# EAGLE design io8 (EAGLE 6.5.0)
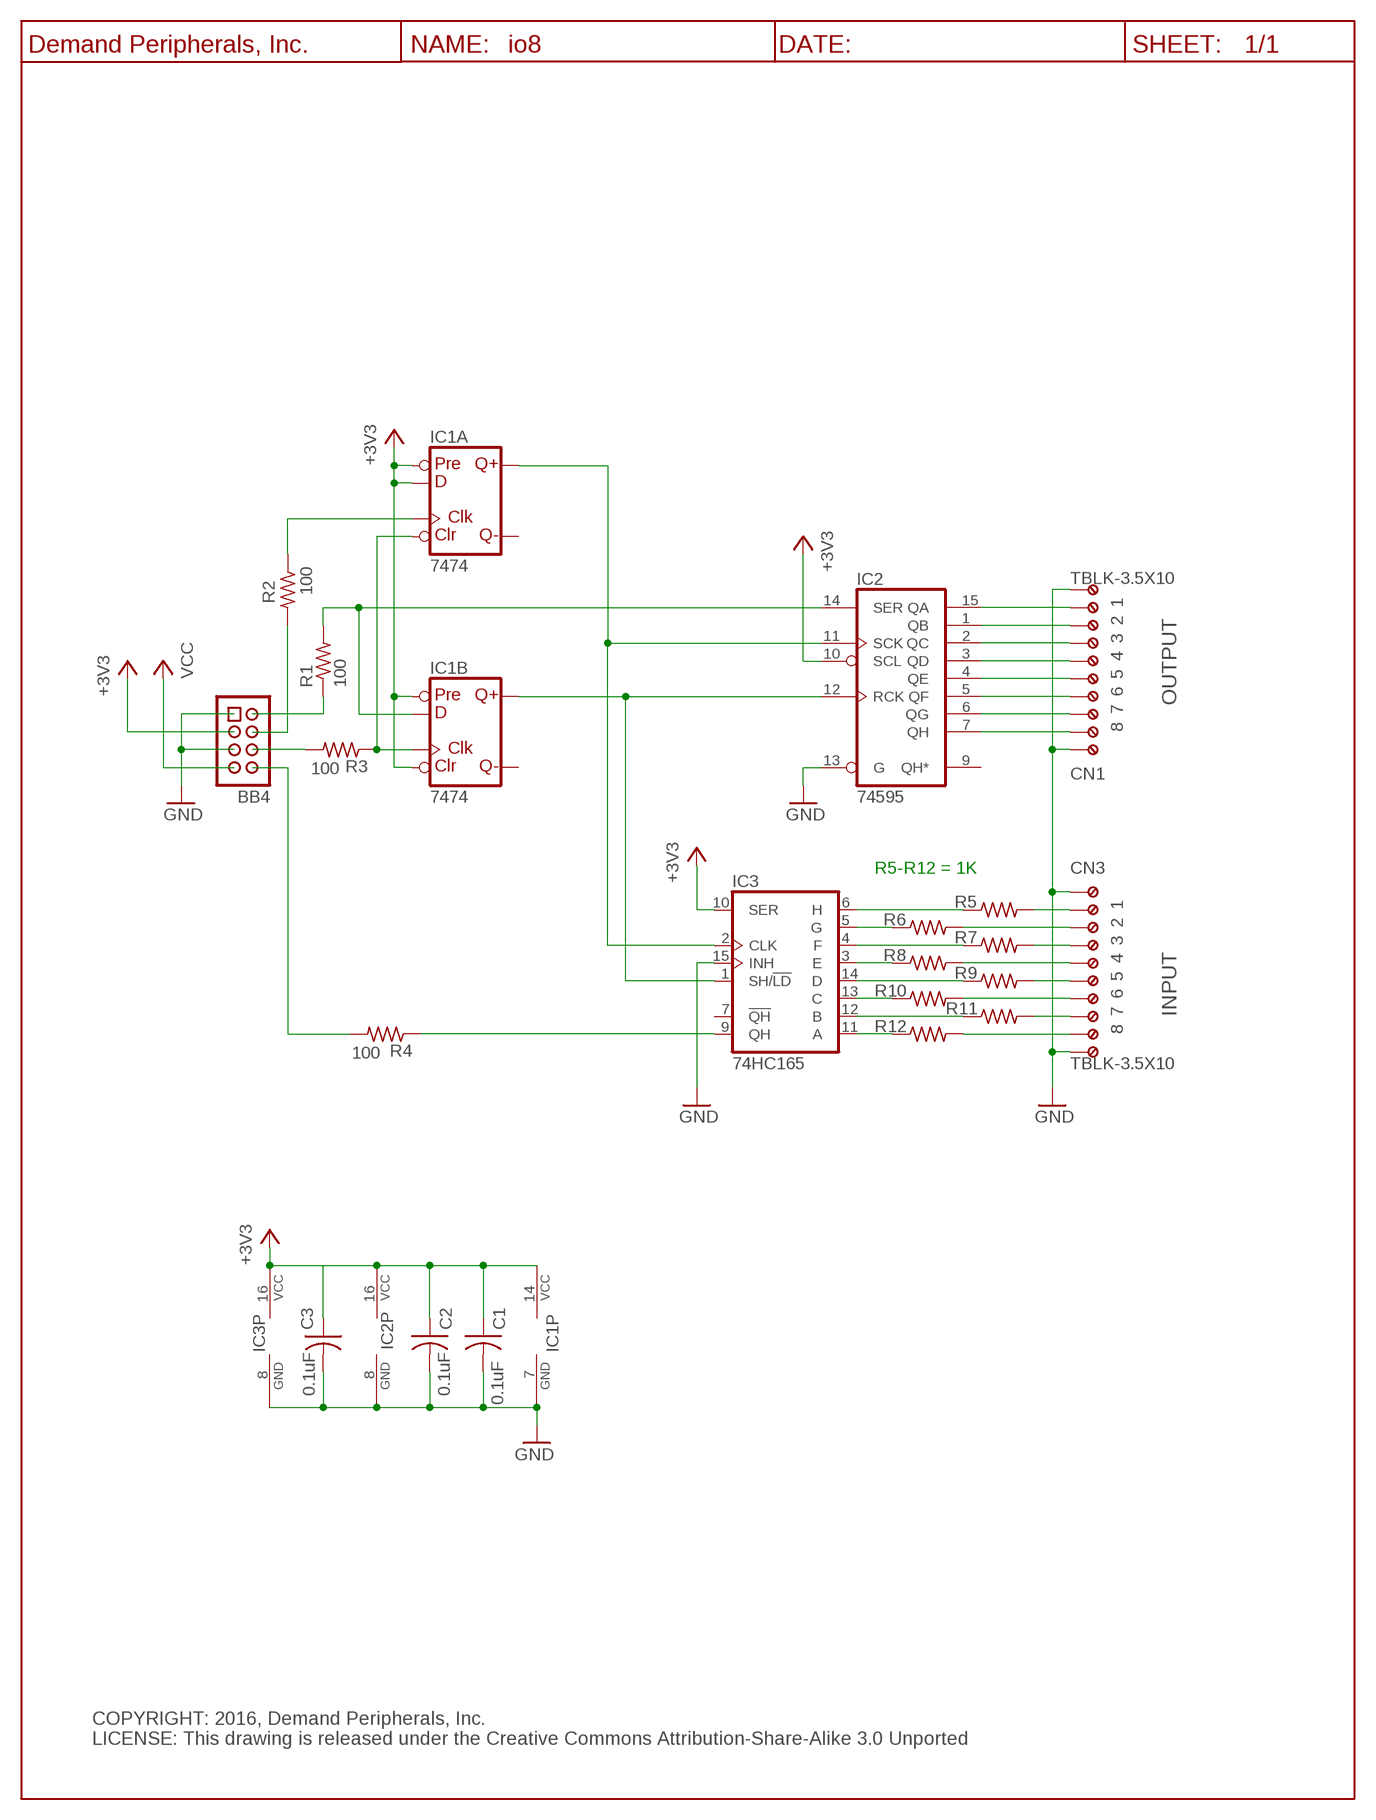
[diagram p0: schematic, sheet 1]

## Parts
BB4  Hdr_4x2  HDR-4X2-SHR  [HDR-4X2]
C1  0.1uF  C0.1UF_C0603  [C0603]
C2  0.1uF  C0.1UF_C0603  [C0603]
C3  0.1uF  C0.1UF_C0603  [C0603]
CN1  TBLK-3.5X10  [TBLK-3.5X10]
CN3  TBLK-3.5X10  [TBLK-3.5X10]
IC1  7474  74AHC74  [SO14]
IC2  74595  [SO16]
IC3  74HC165  [SO16]
R1  100  R100_R0603  [R0603]
R2  100  R100_R0603  [R0603]
R3  100  R100_R0603  [R0603]
R4  100  R100_R0603  [R0603]
R5  R1K_R0603  [R0603]
R6  R1K_R0603  [R0603]
R7  R1K_R0603  [R0603]
R8  R1K_R0603  [R0603]
R9  R1K_R0603  [R0603]
R10  R1K_R0603  [R0603]
R11  R1K_R0603  [R0603]
R12  R1K_R0603  [R0603]
U$5  DP_FRAME_P  [P_FRAME]

## Nets
+3V3: BB4.3 C1.1 C2.1 C3.1 IC1.2(A:D) IC1.4(A:PRE) IC1.10(B:PRE) IC1.13(B:CLR) IC1.14(P:VCC) IC2.10(SCL) IC2.16(VCC) IC3.10(SER) IC3.16(VCC)
GND: BB4.1 BB4.5 C1.2 C2.2 C3.2 CN1.1(KL) CN1.10(KL9) CN3.1(KL) CN3.10(KL9) IC1.7(P:GND) IC2.8(GND) IC2.13(G) IC3.8(GND) IC3.15(INH)
N$1: BB4.2 R1.1
N$2: BB4.8 R4.2
N$3: CN3.9(KL8) R12.2
N$4: CN3.8(KL7) R11.2
N$5: CN3.7(KL6) R10.2
N$6: IC1.12(B:D) IC2.14(SER) R1.2
N$7: CN3.6(KL5) R9.2
N$8: CN3.5(KL4) R8.2
N$9: CN3.4(KL3) R7.2
N$10: CN3.3(KL2) R6.2
N$11: CN3.2(KL1) R5.2
N$12: IC1.5(A:Q) IC2.11(SCK) IC3.2(CLK)
N$13: IC3.11(A) R12.1
N$14: CN1.2(KL1) IC2.7(QH)
N$15: IC1.1(A:CLR) IC1.11(B:CLK) R3.1
N$17: BB4.4 R2.2
N$18: IC1.3(A:CLK) R2.1
N$19: BB4.6 R3.2
N$21: CN1.3(KL2) IC2.6(QG)
N$22: CN1.4(KL3) IC2.5(QF)
N$23: CN1.5(KL4) IC2.4(QE)
N$24: CN1.6(KL5) IC2.3(QD)
N$25: CN1.7(KL6) IC2.2(QC)
N$26: CN1.8(KL7) IC2.1(QB)
N$27: CN1.9(KL8) IC2.15(QA)
N$33: IC3.9(QH) R4.1
N$34: IC3.12(B) R11.1
N$35: IC1.9(B:Q) IC2.12(RCK) IC3.1(SH/!LD)
N$47: IC3.13(C) R10.1
N$48: IC3.14(D) R9.1
N$49: IC3.3(E) R8.1
N$50: IC3.4(F) R7.1
N$51: IC3.5(G) R6.1
N$52: IC3.6(H) R5.1
VCC: BB4.7
Unconnected: IC1.6(A:!Q) IC1.8(B:!Q) IC2.9(QH*) IC3.7(!QH)

## Notes on the sheet
- 1
- 2
- 3
- 4
- 5
- 6
- OUTPUT
- 7
- 8
- R5-R12 = 1K
- 1
- 2
- 3
- 4
- 5
- 6
- 7 | INPUT
- 8
- COPYRIGHT: 2016, Demand Peripherals, Inc.
  LICENSE: This drawing is released under the Creative Commons Attribution-Share-Alike 3.0 Unported

## Library data of the parts
BB4 = dpi-conn:HDR-4X2-SHR: Shrouded 4x2 pin header; VENDOR: Digikey; VENDOR-PART-NUM: 609-3530-ND
C1-C3 = dpi-passive:C0.1UF_: 0.1 uF Capacitor, 25V, X7R; VENDOR: Digikey; VENDOR-PART-NUM: 1276-1126-2-ND
CN1 CN3 = dpi-conn:TBLK-3.5X10: Terminal Block, 3.5mm, x10, screw terminals; VENDOR: Digikey; VENDOR-PART-NUM: ED2735-ND
IC1 = dpi-transic:74AHC74: Dual D type positive edge triggered FLIP FLOP, preset and clear; VENDOR: Digikey; VENDOR-PART-NUM: 568-4458-1-ND
IC2 = dpi-transic:74*595: 8-bit SHIFT REGISTER, output latch; VENDOR: Digikey; VENDOR-PART-NUM: 74HC595D(BJ)CT-ND
IC3 = dpi-transic:74HC165: NXP 74HC165 parallel-to-serial shift register; VENDOR: Digikey; VENDOR-PART-NUM: 568-1409-1-ND
R1-R4 = dpi-passive:R100_: 100 Ohm resistor, 1%, 0.1 watt; VENDOR: Digikey; VENDOR-PART-NUM: 311-100HRTR-ND
R5-R12 = dpi-passive:R1K_: 1K Resistor, 1%, 0.1 watt; VENDOR: Digikey; VENDOR-PART-NUM: 311-1.00KHRTR-ND
U$5 = dpi-sym:DP_FRAME_P: Portrait/Letter Document Frame

## Board
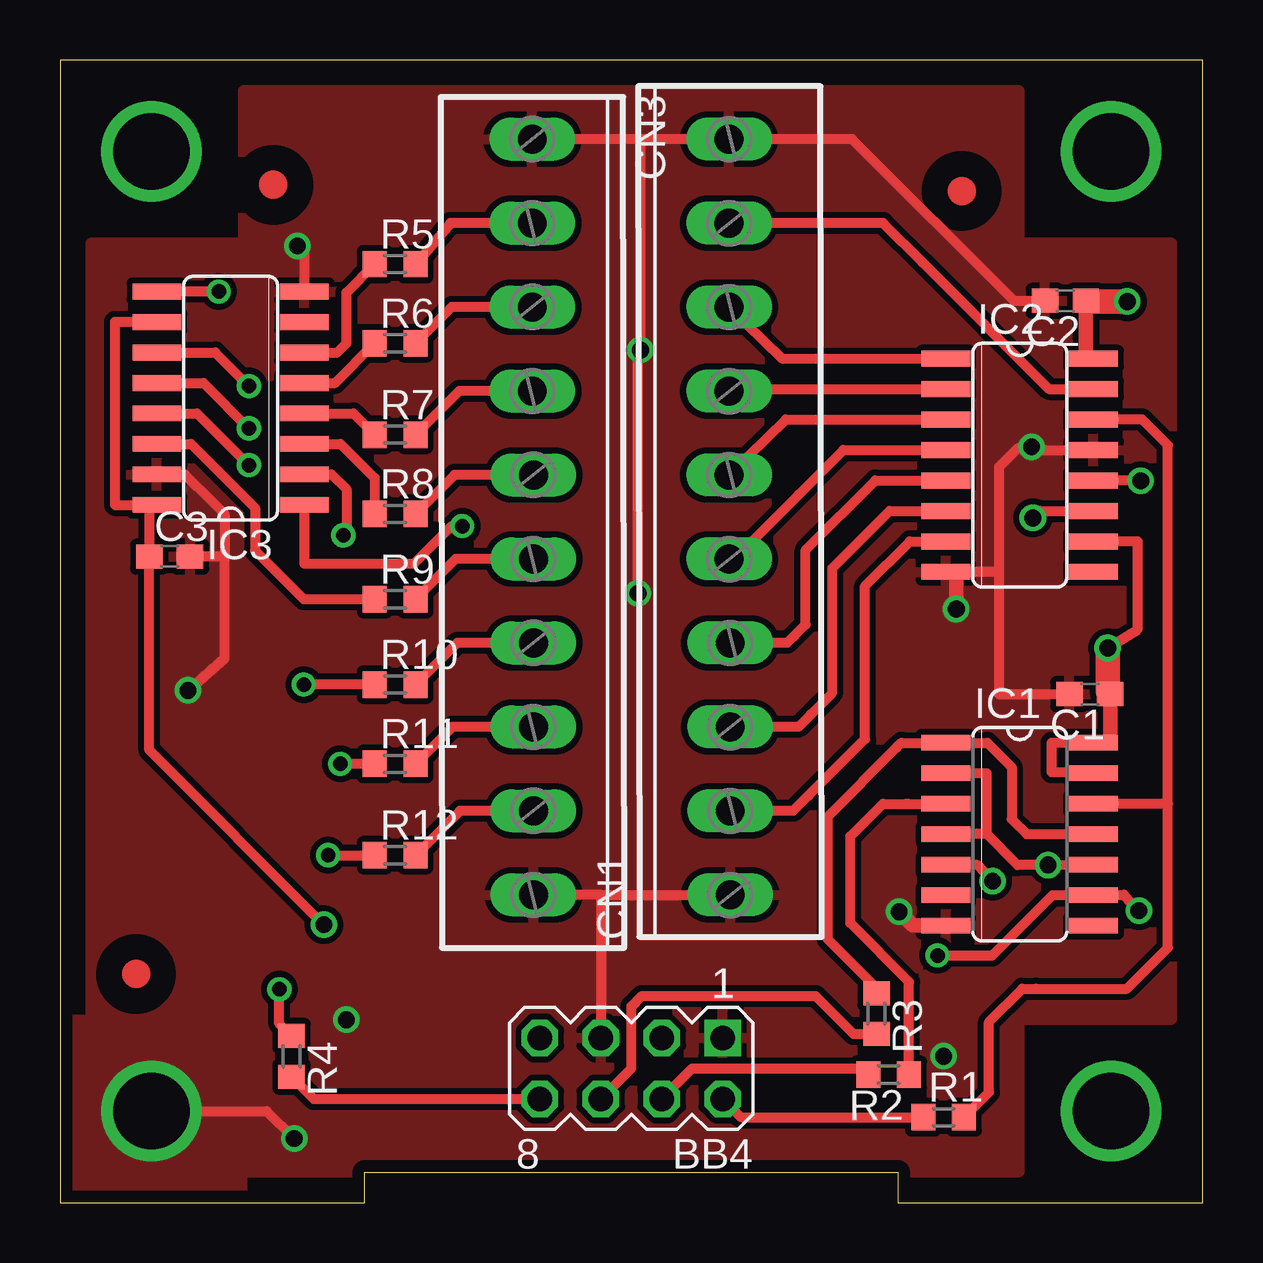
[diagram p1: board, top side]
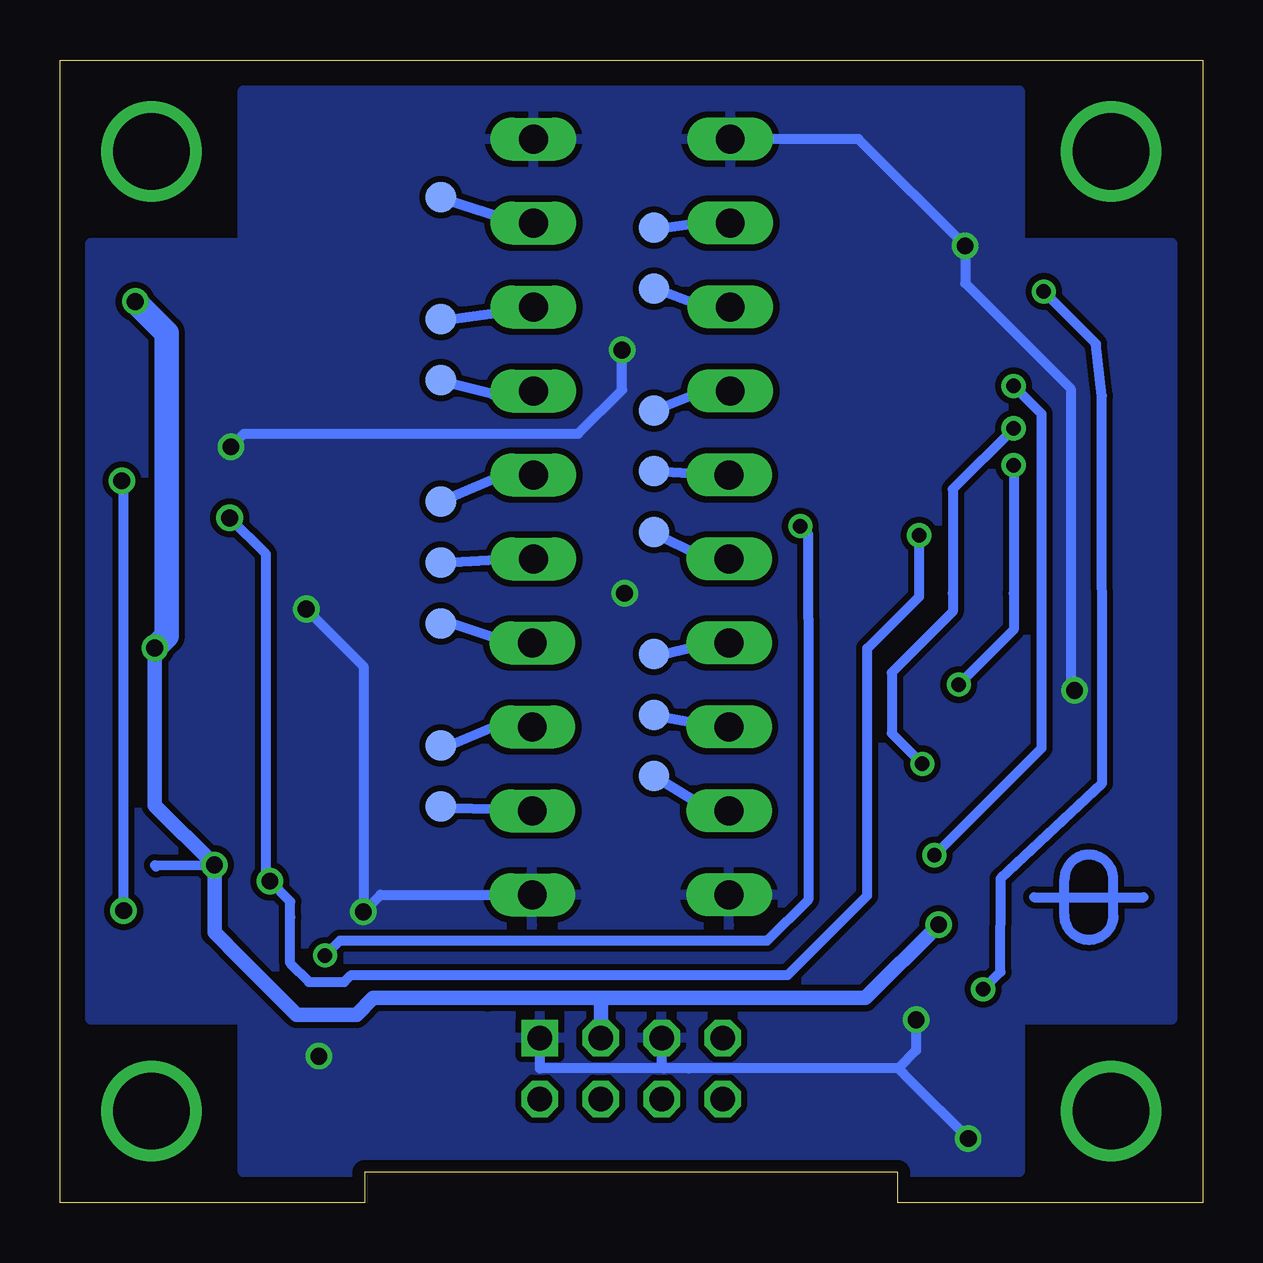
[diagram p2: board, bottom side, seen from below]

Size 47.62 x 47.62 mm. Coordinates in mm from the lower left corner, seen from the top.
Outline: 0,0 12.7,0 12.7,1.27 34.92,1.27 34.92,0 47.62,0 47.62,47.62 0,47.62 0,0
Copper layers (1*16): Top 0.035mm / dielectric 1.5mm / Bottom 0.035mm
Design rules "default *": minimum track width 10mil, minimum drill 20mil, track to track 10mil, track to pad 10mil, pad to pad 10mil, via to via 10mil, smd to smd 10mil, copper to edge 20mil, drill to drill 10mil, minimum pad ring 10mil, minimum via ring 8mil, stop-mask expansion 4mil, vias tented up to drill 0mil, thermal gap 10mil
tKeepout: area 15.1,1 to 32.5,9.7; area 15.1,0.5 to 32.5,9.7

### Footprints (pad centres in the part's own frame; a part is rotated, then mirrored left to right if it is on the bottom)
HDR-4X2 = drill 1.016 square: 1 -3.81,-1.27 | drill 1.016 octagon: 2 -3.81,1.27; 3 -1.27,-1.27; 4 -1.27,1.27; 5 1.27,-1.27; 6 1.27,1.27; 7 3.81,-1.27; 8 3.81,1.27
C0603 = smd 1.1 x 1: 1 -0.85,0; 2 0.85,0
TBLK-3.5X10 = drill 1.2 long: 1 -15.75,0; 2 -12.25,0; 3 -8.75,0; 4 -5.25,0; 5 -1.75,0.05; 6 1.75,0.05; 7 5.25,0.05; 8 8.75,0.05; 9 12.25,0.05; 10 15.75,0.05
TEST-POINT = smd 1.27 x 1.27: P1 0,0
SO14 = smd 0.66 x 2.032: 1 -3.81,-3.073; 2 -2.54,-3.073; 3 -1.27,-3.073; 4 0,-3.073; 5 1.27,-3.073; 6 2.54,-3.073; 7 3.81,-3.073; 8 3.81,3.073; 9 2.54,3.073; 10 1.27,3.073; 11 0,3.073; 12 -1.27,3.073; 13 -2.54,3.073; 14 -3.81,3.073
SO16 = smd 0.66 x 2.032: 1 -4.445,-3.073; 2 -3.175,-3.073; 3 -1.905,-3.073; 4 -0.635,-3.073; 5 0.635,-3.073; 6 1.905,-3.073; 7 3.175,-3.073; 8 4.445,-3.073; 9 4.445,3.073; 10 3.175,3.073; 11 1.905,3.073; 12 0.635,3.073; 13 -0.635,3.073; 14 -1.905,3.073; 15 -3.175,3.073; 16 -4.445,3.073
R0603 = smd 1 x 1.1: 1 -0.85,0; 2 0.85,0

### Placement (x,y rotation side)
BB4  23.81,5.59 180 top
C1  42.93,21.2 180 top
C2  41.91,37.59 180 top
C3  4.57,26.92 0 top
CN1  27.94,28.57 90 top
CN3  19.68,28.57 270 top
E$2  [TEST-POINT]  22.86,40.64 0 bottom
E$4  [TEST-POINT]  31.75,41.91 0 bottom
E$5  [TEST-POINT]  22.86,38.09 0 bottom
E$6  [TEST-POINT]  31.75,36.83 0 bottom
E$7  [TEST-POINT]  22.86,33.02 0 bottom
E$8  [TEST-POINT]  31.75,34.29 0 bottom
E$9  [TEST-POINT]  22.87,30.48 0 bottom
E$10  [TEST-POINT]  31.75,29.21 0 bottom
E$11  [TEST-POINT]  22.86,27.94 0 bottom
E$12  [TEST-POINT]  31.75,26.67 0 bottom
E$13  [TEST-POINT]  22.86,22.86 0 bottom
E$14  [TEST-POINT]  31.75,24.13 0 bottom
E$15  [TEST-POINT]  22.86,20.32 0 bottom
E$16  [TEST-POINT]  22.86,17.78 0 bottom
E$18  [TEST-POINT]  31.75,19.05 0 bottom
E$19  [TEST-POINT]  31.75,16.51 0 bottom
IC1  40.01,15.35 270 top
IC2  40.01,30.73 270 top
IC3  7.11,33.53 90 top
R1  36.83,3.56 0 top
R2  34.54,5.33 180 top
R3  34.04,7.87 270 top
R4  9.65,6.1 270 top
R5  13.97,39.12 0 top
R6  13.97,35.81 0 top
R7  13.97,32 0 top
R8  13.97,28.7 0 top
R9  13.97,25.15 0 top
R10  13.97,21.59 0 top
R11  13.97,18.29 0 top
R12  13.97,14.48 0 top
U$1  [FIDUCIAL]  3.17,9.53 0 top
U$3  [FIDUCIAL]  37.59,42.16 0 top
U$4  [FIDUCIAL]  8.89,42.42 0 top
U$5  -2.54,-2.54 0 top
U$6  [DPI-1]  4.74,12.73 90 bottom

### Tracks (layer width: path | path; a pad name or v marks a point on that pad's centre or on a via)
+3V3  (via drill 0.7)
  Top 0.406: IC1.14 41.33,19.16 41.33,17.95 43.08,17.95 IC1.13 | 38.63,15.35 IC1.4 | IC2.10 44.92,27.56 44.92,23.89 v43.67,23.11 | IC1.2 38.63,17.89 38.63,15.35 | IC1.10 v41.19,14.07 39.92,14.07 38.63,15.35 | IC3.10 2.29,36.7 2.29,29.08 IC3.16 3.72,29.08 C3.1 3.72,18.86 v11,11.58
  Top 0.61: IC2.16 42.76,35.18 C2.1 | IC1.14 43.78,19.16 C1.1
  Top 1.016: v44.49,37.55 42.8,37.55 C2.1 | v43.67,23.11 43.67,21.3 C1.1
  Bottom 0.406: 43.62,14.01 43.67,14.06 v41.19,14.07
  Bottom 0.61: v43.67,23.11 43.67,16.56 v41.19,14.07 41.19,11.25 40.07,10.13 37.76,7.82 35.27,7.82 34.57,8.52 29.82,8.52 25.08,8.52 | BB4.3 25.08,8.52 | 25.08,8.52 14.06,8.52 v11,11.58
  Bottom 1.016: v43.67,23.11 43.17,23.62 43.17,36.23 v44.49,37.55
GND  (via drill 0.7, 3.17 pad 3.17)
  Top 0.406: IC2.13 40.63,31.37 40.58,31.42 | v40.5,31.5 40.58,31.42 | 39.14,26.29 IC2.8 | 39.14,26.29 39.14,30.66 39.9,31.42 40.58,31.42 | 22.54,12.82 BB4.5 | C1.2 39.14,21.2 39.14,26.29 | C2.2 39.75,37.59 33.02,44.33 CN1.10 24.32,44.33 | 24.32,44.33 CN3.1 | 22.54,12.82 CN3.10 | 22.54,12.82 CN1.1 | v3.81,3.81 8.62,3.81 v9.77,2.67 | v24.09,25.4 24.09,35.43 v24.19,35.53 24.19,44.2 24.32,44.33 | v9.89,39.88 10.19,39.59 IC3.8 | IC3.15 5.21,30.35 6.35,29.21 6.86,28.7 6.86,26.92 | 6.86,26.92 C3.2 | v5.33,21.35 6.86,22.67 6.86,26.92
  Top 0.61: v37.36,24.74 37.36,26.25 IC2.8 | IC1.7 35.55,11.54 v34.98,12.12
  Bottom 0.406: v37.36,24.74 34.98,22.35 v34.98,12.12 34.27,12.82 CN1.1 | v9.77,2.67 12.18,5.08 12.69,5.59 | 12.69,5.59 21.43,5.59 22.47,5.59 | 22.47,5.59 27.62,5.59 BB4.1 | BB4.5 22.54,5.66 22.47,5.59 | v40.5,31.5 39.95,32.04 26.02,32.04 24.19,33.87 v24.19,35.53 | v11.94,7.62 11.94,6.34 12.69,5.59 | CN3.1 14.34,44.33 v9.89,39.88 9.89,38.32 5.5,33.92 5.5,21.51 v5.33,21.35
  other vias: 36.83,6.1
  pour Top (isolate 0.254): 40.01,1.27 40.01,7.62 46.35,7.62 46.35,40.01 40.01,40.01 40.01,46.35 7.62,46.35 7.62,40.01 1.27,40.01 1.27,7.62 0.51,7.62 0.51,0.51 7.62,0.51 7.62,1.27
  pour Bottom (isolate 0.254): 40.01,1.27 40.01,7.62 46.35,7.62 46.35,40.01 40.01,40.01 40.01,46.35 7.62,46.35 7.62,40.01 1.27,40.01 1.27,7.62 7.62,7.62 7.62,1.27
MOUNT  (via drill 3.17 pad 3.17)
  other vias: 43.81,43.81
N$1
  Top 0.406: BB4.2 28.38,3.56 R1.1
N$2
  Top 0.406: R4.2 10.58,4.32 BB4.8
N$3
  Top 0.406: CN3.9 16.67,16.32 R12.2
N$4
  Top 0.406: CN3.8 16.36,19.82 R11.2
N$5
  Top 0.406: CN3.7 16.55,23.32 R10.2
N$6
  Top 0.406: IC2.14 45.11,32.64 46.18,31.57 46.18,16.62 | 46.18,16.62 46.18,10.62 44.48,8.91 40.69,8.91 40.11,8.91 38.72,7.53 38.72,4.6 R1.2 | 46.18,16.62 IC1.12
N$7
  Top 0.406: CN3.6 16.5,26.82 R9.2
N$8
  Top 0.406: CN3.5 16.44,30.32 R8.2
N$9
  Top 0.406: CN3.4 16.64,33.83 R7.2
N$10
  Top 0.406: CN3.3 16.33,37.33 R6.2
N$11
  Top 0.406: CN3.2 16.27,40.83 R5.2
N$12  (via drill 0.6, 0.7)
  Top 0.406: IC2.11 40.84,28.83 v40.55,28.54 | IC1.5 38.24,14.07 v38.88,13.4 | IC3.2 11.32,30.35 11.94,29.73 11.94,27.94 v11.81,27.81
  Bottom 0.406: v40.55,28.54 39.04,27.03 39.04,25.74 39.04,13.56 v38.88,13.4 38.02,12.55 38.02,11.89 38.02,9.97 37.25,9.2 35.78,9.2 35.48,9.49 32.82,9.49 17.29,9.49 13.97,12.8 13.97,23.1 11.81,25.26 v11.81,27.81
N$13  (via drill 0.6)
  Top 0.406: IC3.11 6.48,35.43 v7.87,34.04 | v11.18,14.48 R12.1
  Bottom 0.406: v7.87,34.04 6.72,32.88 6.72,23.57 6.72,18.94 v11.18,14.48
N$14
  Top 0.406: IC2.7 35.42,27.56 33.55,25.69 33.55,19.32 31.2,16.97 30.56,16.32 CN1.2
N$15
  Top 0.406: IC1.11 40.3,15.35 39.67,15.98 39.67,18.14 38.65,19.16 IC1.1 35.08,19.16 34.87,18.96 32,16.09 32,13.66 32,10.97 34.04,8.94 R3.1
N$16
  Bottom 0.406: 31.39,41.76 29.36,41.11
N$17
  Top 0.406: BB4.4 26.35,5.59 27.85,5.59 33.19,5.59 R2.2
N$18
  Top 0.406: 35.28,16.62 35.36,16.62 | 35.36,16.62 IC1.3 | R2.1 35.39,9.2 32.94,11.65 32.94,15.27 34.3,16.62 35.36,16.62
N$19
  Top 0.406: BB4.6 23.81,5.59 23.81,7.37 23.81,8.18 24.24,8.61 31.5,8.61 33.05,7.06 33.08,7.02 R3.2
N$20
  Bottom 0.406: 29.5,37.06 31.32,36.8
N$21
  Top 0.406: IC2.6 34.58,28.83 32.19,26.44 32.19,21.25 31.29,20.34 30.77,19.82 CN1.3
N$22
  Top 0.406: IC2.5 33.98,30.1 31.08,27.19 31.08,24.09 30.59,23.61 30.31,23.32 CN1.4
N$23
  Top 0.406: IC2.4 32.65,31.37 30.8,29.52 28.11,26.82 CN1.5
N$24
  Top 0.406: IC2.3 30.25,32.64 CN1.6
N$25
  Top 0.406: IC2.2 28.02,33.91 CN1.7
N$26
  Top 0.406: IC2.1 30.09,35.18 CN1.8
N$27
  Top 0.406: IC2.15 41.22,33.91 35.94,39.19 34.31,40.83 CN1.9
N$28
  Bottom 0.406: 29.6,33.69 31.27,34.12
N$29
  Bottom 0.406: 29.27,30.26 31.28,29.41
N$30
  Bottom 0.406: 29.38,26.77 31.24,26.67
N$31
  Bottom 0.406: 29.53,23.55 31.22,24.11
N$32
  Bottom 0.406: 29.63,19.77 31.32,19.07
N$33  (via drill 0.6)
  Top 0.406: R4.1 9.14,7.45 v9.14,8.89 | v6.62,37.97 IC3.9
  Bottom 0.406: v9.14,8.89 8.42,9.61 8.41,13.5 4.18,17.48 4.19,33.62 4.45,35.8 v6.62,37.97
N$34  (via drill 0.6)
  Top 0.406: IC3.12 5.98,34.16 v7.87,32.27 | R11.1 v11.69,18.29 v11.68,18.29
  Bottom 0.406: v7.87,32.27 10.41,29.73 10.41,25.4 10.41,24.62 12.95,22.09 12.95,19.56 v11.68,18.29
N$35  (via drill 0.6, 0.7)
  Top 0.406: v44.97,12.17 44.35,12.83 IC1.9 41.38,12.81 38.86,10.3 v36.58,10.3 | IC2.12 44.51,30.1 v45.05,30.09 | IC3.1 10.19,26.62 14.74,26.62 14.81,26.68 16.32,28.19 v16.76,28.19
  Bottom 0.406: v45.05,30.09 44.97,29.64 v44.97,12.17 | v36.58,10.3 35.97,10.91 32.12,10.91 18.15,10.91 16.43,12.62 16.43,24.36 16.43,27.86 v16.76,28.19
N$36
  Bottom 0.406: 29.53,16.4 31.32,16.43
N$37
  Bottom 0.406: 22.52,17.56 21.11,16.71
N$38
  Bottom 0.406: 22.59,20.27 21.22,20.02
N$39
  Bottom 0.406: 22.52,22.84 21.25,23.15
N$40
  Bottom 0.406: 22.66,27.8 21.14,27.06
N$41  (via drill 3.17 pad 3.17)
  other vias: 3.81,43.81
N$42
  Bottom 0.406: 22.48,30.47 21.36,30.4
N$43  (via drill 3.17 pad 3.17)
  other vias: 43.81,3.81
N$44
  Bottom 0.406: 22.42,40.64 21.25,40.8
N$45
  Bottom 0.406: 22.44,37.97 21.35,37.55
N$46
  Bottom 0.406: 22.44,33.19 21.2,33.68
N$47  (via drill 0.6)
  Top 0.406: IC3.13 5.71,32.89 v7.87,30.73 | R10.1 v10.16,21.59
  Bottom 0.406: v7.87,30.73 7.87,25.4 7.87,23.88 v10.16,21.59
N$48
  Top 0.406: IC3.14 5.46,31.62 8.13,28.96 8.13,27.18 10.16,25.15 R9.1
N$49
  Top 0.406: IC3.3 11.7,31.62 13.12,30.2 R8.1
N$50
  Top 0.406: IC3.4 12.23,32.89 R7.1
N$51
  Top 0.406: IC3.5 11.47,34.16 R6.1
N$52
  Top 0.406: IC3.6 11.56,35.43 11.94,35.81 11.94,37.93 R5.1

### Text on the board
tTest: 1.875 Inches | 1.575 Inches | In | Out | 1 | 1 | IO8-ST, Rev 17A | R5 | 2 | C2 | 2 | IC2 | 3 | R6 | 3 | R7 | 4 | 4 | R8 | IC3 | 5 | 5 | C3 | R9 | 6 | 6 | C1 | 7 | R10 | IC1 | 7 | R11 | 8 | 8 | 1.575 Inches | 1.875 Inches | R12 | BB4 | R3 | (C) 2017, Demand Peripherals, Inc. | R2 | R4 | R1